# EAGLE design USTREDNA (EAGLE 7.7.0)
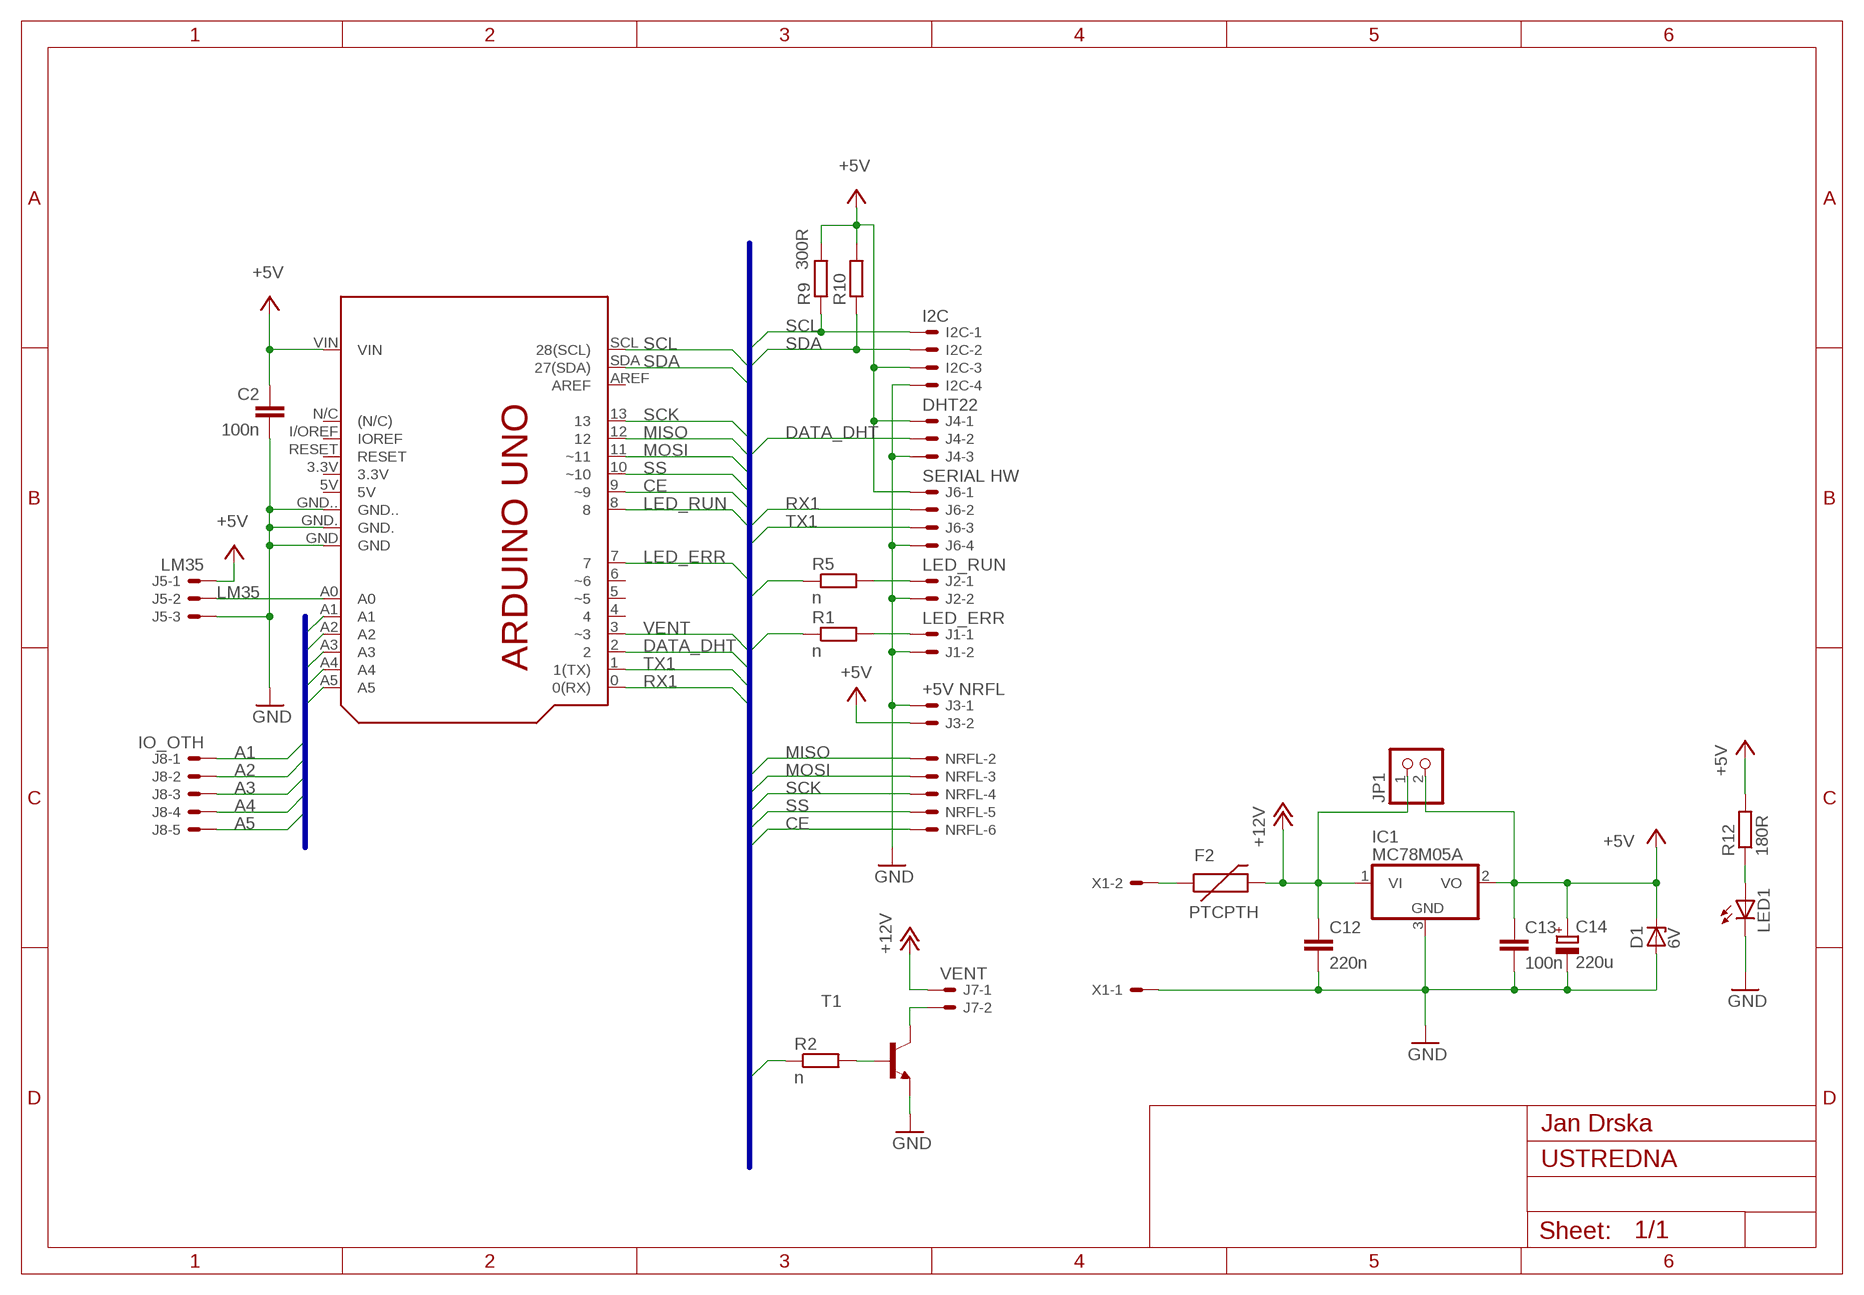
[diagram p0: schematic, sheet 1]

## Parts
C2  100n  C-EUC0603  [C0603]
C12  220n  C-EUC0603  [C0603]
C13  100n  C-EUC0603  [C0603]
C14  220u  CPOL-EUE2,5-6E  [E2,5-6E]
D1  6V  ZENER-DIODESMB  [SMB]
F2  PTCPTH  [PTC]
I2C  I2C  22-27-2041-04  [6410-04]
IC1  MC78M05A  7808DT  [TO252]
J1  LED_ERR  22-27-2021-02  [6410-02]
J2  LED_RUN  22-27-2021-02  [6410-02]
J3  +5V NRFL  22-27-2021-02  [6410-02]
J4  DHT22  22-27-2031-03  [6410-03]
J5  LM35  22-27-2031-03  [6410-03]
J6  SERIAL HW  22-27-2041-04  [6410-04]
J7  VENT  22-27-2021-02  [6410-02]
J8  IO_OTH  22-27-2051-05  [6410-05]
JP1  PINHD-1X2  [1X02]
LED1  LEDCHIP-LED0603  [CHIP-LED0603]
NRFL  NRFL  22-27-2061-06  [6410-06]
PCB1  ARDUINO_UNO  [ARDUINO_UNO]
R1  n  R-EU_R0603  [R0603]
R2  n  R-EU_R0603  [R0603]
R5  n  R-EU_R0603  [R0603]
R9  R-EU_R0603  [R0603]
R10  300R  R-EU_R0603  [R0603]
R12  180R  R-EU_R0603  [R0603]
T1  -NPN-SOT223  [SOT223]
X1  22-23-2021  [22-23-2021]

## Nets
+5V: C2.1 C13.1 C14.+ D1.C I2C.3 IC1.2(VO) J3.2 J4.1 J5.1 J6.1 JP1.2 PCB1.VIN R9.2 R10.2 R12.2
+12V: C12.1 F2.P$2 IC1.1(VI) J7.1 JP1.1
A1: J8.1 PCB1.A1
A2: J8.2 PCB1.A2
A3: J8.3 PCB1.A3
A4: J8.4 PCB1.A4
A5: J8.5 PCB1.A5
CE: NRFL.6 PCB1.9(~9)
DATA_DHT: J4.2 PCB1.2
GND: C2.2 C12.2 C13.2 C14.- D1.A I2C.4 IC1.3(GND) J1.2 J2.2 J3.1 J4.3 J5.3 J6.4 LED1.C PCB1.GND PCB1.GND. PCB1.GND.. T1.3(E) X1.1
LED_ERR: PCB1.7 R1.1
LED_RUN: PCB1.8 R5.1
LM35: J5.2 PCB1.A0
MISO: NRFL.2 PCB1.12
MOSI: NRFL.3 PCB1.11(~11)
N$1: J1.1 R1.2
N$2: R2.2 T1.1(B)
N$3: J2.1 R5.2
N$4: J7.2 T1.4(C)
N$8: F2.P$1 X1.2
N$11: LED1.A R12.1
RX1: J6.2 PCB1.0(0(RX))
SCK: NRFL.4 PCB1.13
SCL: I2C.1 PCB1.SCL(28(SCL)) R9.1
SDA: I2C.2 PCB1.SDA(27(SDA)) R10.1
SS: NRFL.5 PCB1.10(~10)
TX1: J6.3 PCB1.1(1(TX))
VENT: PCB1.3(~3) R2.1
Unconnected: NRFL.1 PCB1.3.3V PCB1.4 PCB1.5(~5) PCB1.5V PCB1.6(~6) PCB1.AREF PCB1.I/OREF(IOREF) PCB1.N/C((N/C)) PCB1.RESET

## Buses
SDA,SCL,LED_RUN,RX1,TX1,SCK,MOSI,MISO,SS,CE,LED_ERR,DATA_DHT,VENT
A[1..5]

## Library data of the parts
C2 C12 C13 = rcl:C-EU: CAPACITOR, European symbol
C14 = rcl:CPOL-EU: POLARIZED CAPACITOR, European symbol
D1 = diode:ZENER-DIODE: Z-Diode
F2 = SparkFun:PTC: Resettable Fuse PTC Resettable Fuse. Spark Fun Electronics SKU : COM-08357
I2C J6 = con-molex:22-?-04: CONNECTOR wire to board 2.54 mm (.1 inch) pitch header; OC_FARNELL: unknown; OC_NEWARK: unknown
IC1 = linear:78*: Positive VOLTAGE REGULATOR Source: http://cache.national.com/ds/LM/LM78L05.pdf http://www.fairchildsemi.com/ds/LM/LM7805.pdf
J1-J3 J7 = con-molex:22-?-02: CONNECTOR wire to board 2.54 mm (.1 inch) pitch header; OC_FARNELL: unknown; OC_NEWARK: unknown
J4 J5 = con-molex:22-?-03: CONNECTOR wire to board 2.54 mm (.1 inch) pitch header; OC_FARNELL: unknown; OC_NEWARK: unknown
J8 = con-molex:22-?-05: CONNECTOR wire to board 2.54 mm (.1 inch) pitch header; OC_FARNELL: unknown; OC_NEWARK: unknown
JP1 = pinhead:PINHD-1X2: PIN HEADER
LED1 = led:LED: LED OSRAM: - CHIPLED LG R971, LG N971, LY N971, LG Q971, LY Q971, LO R971, LY R971 LH N974, LH R974 LS Q976, LO Q976, LY Q976 LO Q996 - Hyper CHIPLED LW Q18S LB Q993, LB Q99A, LB R99A - SideLED LS A670, LO A670, LY A670, LG A670, LP A670 LB A673, LV A673, LT A673, LW A673 LH A674 LY A675 LS A676, LA A676, LO A676, LY A676, LW A676 LS A679, LY A679, LG A679 - Hyper Micro SIDELED® LS Y876, LA Y876, LO Y876, LY Y876 LT Y87S - SmartLED LW L88C, LW L88S LB L89C, LB L89S, LG L890 LS L89K, LO L89K, LY L89K LS L896, LA L896, LO L896, LY L896 - TOPLED LS T670, LO T670, LY T670, LG T670, LP T670 LSG T670, LSP T670, LSY T670, LOP T670, LYG T670 LG T671, LOG T671, LSG T671 LB T673, LV T673, LT T673, LW T673 LH T674 LS T676, LA T676, LO T676, LY T676, LB T676, LH T676, LSB T676, LW T676 LB T67C, LV T67C, LT T67C, LS T67K, LO T67K, LY T67K, LW E67C LS E67B, LA E67B, LO E67B, LY E67B, LB E67C, LV E67C, LT E67C LW T67C LS T679, LY T679, LG T679 LS T770, LO T770, LY T770, LG T770, LP T770 LB T773, LV T773, LT T773, LW T773 LH T774 LS E675, LA E675, LY E675, LS T675 LS T776, LA T776, LO T776, LY T776, LB T776 LHGB T686 LT T68C, LB T68C - Hyper Mini TOPLED® LB M676 - Mini TOPLED Santana® LG M470 LS M47K, LO M47K, LY M47K Source: http://www.osram.convergy.de LUXEON: - LUMILED® LXK2-PW12-R00, LXK2-PW12-S00, LXK2-PW14-U00, LXK2-PW14-V00 LXK2-PM12-R00, LXK2-PM12-S00, LXK2-PM14-U00 LXK2-PE12-Q00, LXK2-PE12-R00, LXK2-PE12-S00, LXK2-PE14-T00, LXK2-PE14-U00 LXK2-PB12-K00, LXK2-PB12-L00, LXK2-PB12-M00, LXK2-PB14-N00, LXK2-PB14-P00, LXK2-PB14-Q00 LXK2-PR12-L00, LXK2-PR12-M00, LXK2-PR14-Q00, LXK2-PR14-R00 LXK2-PD12-Q00, LXK2-PD12-R00, LXK2-PD12-S00 LXK2-PH12-R00, LXK2-PH12-S00 LXK2-PL12-P00, LXK2-PL12-Q00, LXK2-PL12-R00 Source: www.luxeon.com KINGBRIGHT: KA-3528ASYC Source: www.kingbright.com
NRFL = con-molex:22-?-06: CONNECTOR wire to board 2.54 mm (.1 inch) pitch header; OC_FARNELL: unknown; OC_NEWARK: unknown
PCB1 = E14_Arduino_revC:ARDUINO_UNO: Device for representing an Arduino Uno board with a footprint in an EAGLE design. Created by Dave Young for Element14. More EAGLE documentation at: http://www.element14.com/community/community/knode/cadsoft_eagle
R1 R2 R5 R9 R10 R12 = rcl:R-EU_: RESISTOR, European symbol
T1 = transistor-neu-to92:*-NPN-: NPN Transistror
X1 = con-molex:22-23-2021: .100" (2.54mm) Center Header - 2 Pin; MF: MOLEX; MPN: 22-23-2021; OC_FARNELL: 1462926; OC_NEWARK: 25C3832

## Board
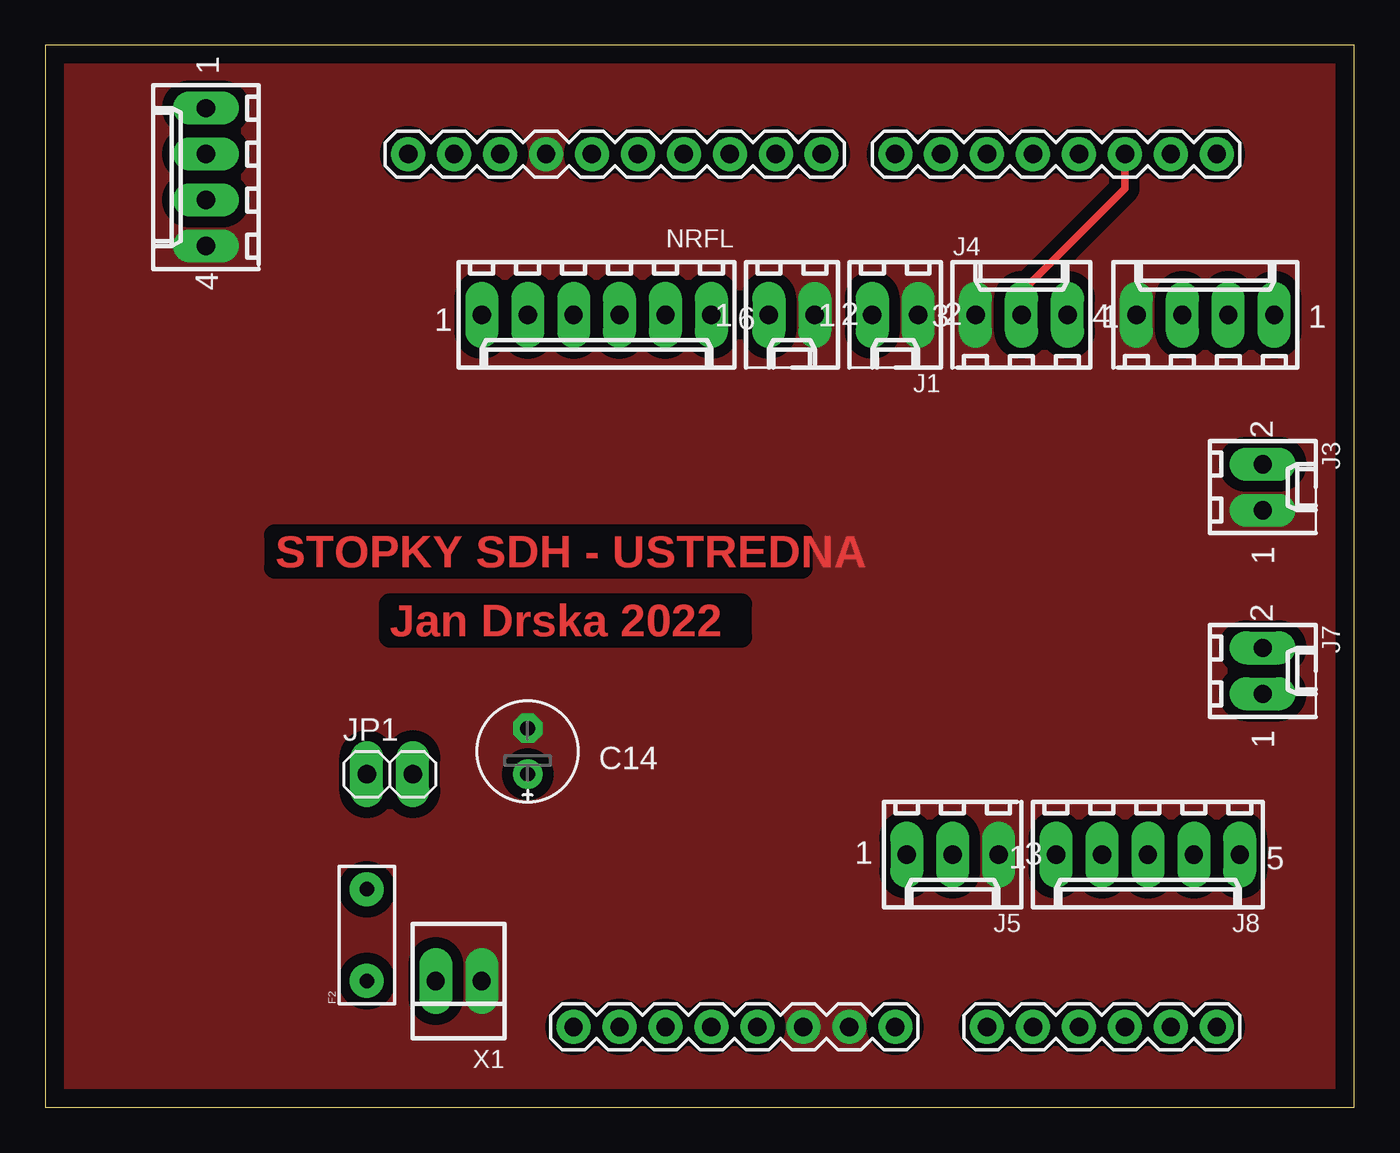
[diagram p1: board, top side]
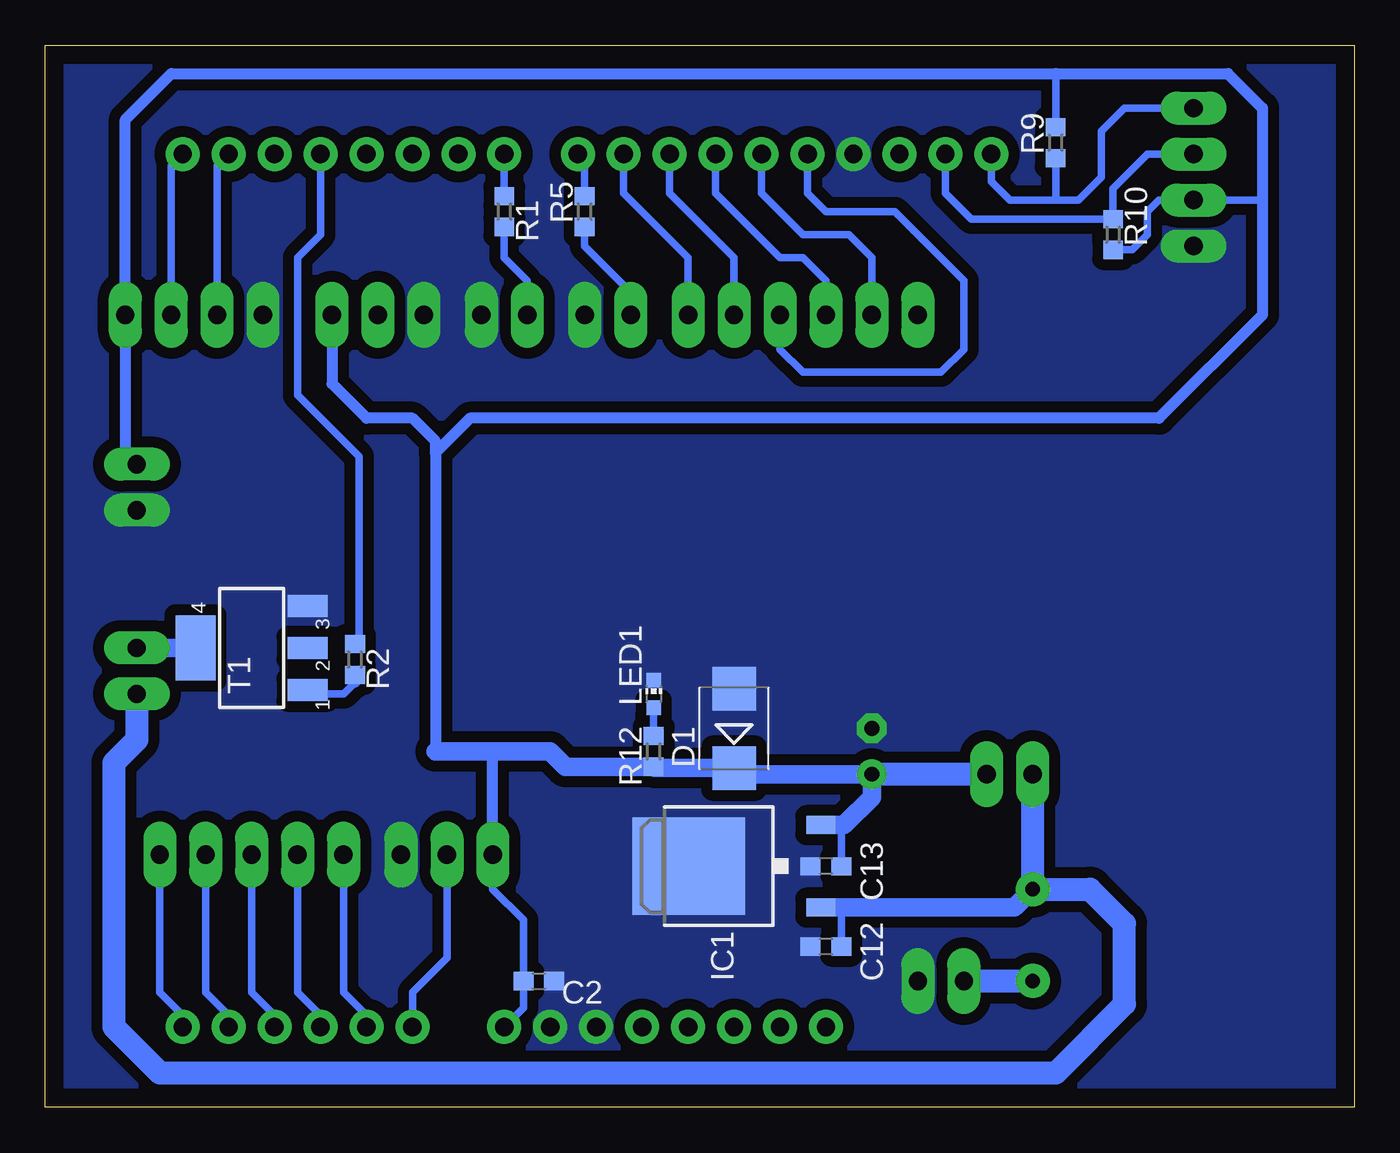
[diagram p2: board, bottom side, seen from below]

Size 72.37 x 58.73 mm. Coordinates in mm from the lower left corner, seen from the top.
Outline: 0,0 72.37,0 72.37,58.73 0,58.73 0,0
Copper layers (1*16): Top 0.035mm / dielectric 1.5mm / Bottom 0.035mm
Design rules "VUT": minimum track width 10mil, minimum drill 24mil, track to track 10mil, track to pad 8mil, pad to pad 8mil, via to via 8mil, smd to smd 8mil, copper to edge 40mil, drill to drill 8mil, minimum pad ring 16mil, minimum via ring 16mil, stop-mask expansion 4mil, vias tented up to drill 0mil, thermal gap 10mil

### Footprints (pad centres in the part's own frame; a part is rotated, then mirrored left to right if it is on the bottom)
C0603 = smd 1.1 x 1: 1 -0.85,0; 2 0.85,0
E2,5-6E = drill 0.813 pad 1.575: + -1.27,0 | drill 0.813 pad 1.575 octagon: - 1.27,0
SMB = smd 2.4 x 2.4: A 2.2,0; C -2.2,0
PTC = drill 0.8 pad 1.88: P$1 -2.54,0; P$2 2.54,0
6410-04 = drill 1.016 long: 1 3.81,0; 2 1.27,0; 3 -1.27,0; 4 -3.81,0
TO252 = smd 1 x 1.6: 1 -2.28,-4.8; 2 2.28,-4.8 | smd 5.4 x 6.2: 3 0,2.5
6410-02 = drill 1.016 long: 1 1.27,0; 2 -1.27,0
6410-03 = drill 1.016 long: 1 2.54,0; 2 0,0; 3 -2.54,0
6410-05 = drill 1.016 long: 1 5.08,0; 2 2.54,0; 3 0,0; 4 -2.54,0; 5 -5.08,0
1X02 = drill 1.016 long: 1 -1.27,0; 2 1.27,0
CHIP-LED0603 = smd 0.8 x 0.8: A 0,-0.75; C 0,0.75
6410-06 = drill 1.016 long: 1 6.35,0; 2 3.81,0; 3 1.27,0; 4 -1.27,0; 5 -3.81,0; 6 -6.35,0
ARDUINO_UNO = drill 1.016 pad 1.88: 0 63.5,50.8; 1 60.96,50.8; 2 58.42,50.8; 3 55.88,50.8; 3.3V 35.56,2.54; 4 53.34,50.8; 5 50.8,50.8; 5V 38.1,2.54; 6 48.26,50.8; 7 45.72,50.8; 8 41.656,50.8; 9 39.116,50.8; 10 36.576,50.8; 11 34.036,50.8; 12 31.496,50.8; 13 28.956,50.8; A0 50.8,2.54; A1 53.34,2.54; A2 55.88,2.54; A3 58.42,2.54; A4 60.96,2.54; A5 63.5,2.54; AREF 23.876,50.8; GND 26.416,50.8; GND. 43.18,2.54; GND.. 40.64,2.54; I/OREF 30.48,2.54; N/C 27.94,2.54; RESET 33.02,2.54; SCL 18.796,50.8; SDA 21.336,50.8; VIN 45.72,2.54
R0603 = smd 1 x 1.1: 1 -0.85,0; 2 0.85,0
SOT223 = smd 1.219 x 2.235: 1 -2.311,-3.099; 2 0,-3.099; 3 2.311,-3.099 | smd 3.6 x 2.2: 4 0,3.099
22-23-2021 = drill 1 long: 1 -1.27,0; 2 1.27,0

### Placement (x,y rotation side)
C2  45.09,6.99 0 bottom
C12  29.21,8.89 180 bottom
C13  29.21,13.34 180 bottom
C14  26.67,19.68 90 top
D1  34.29,20.95 90 bottom
F2  17.78,9.53 90 top
I2C  8.89,51.44 90 top
IC1  34.29,13.34 90 bottom
J1  46.99,43.81 180 top
J2  41.27,43.81 180 top
J3  67.31,34.29 270 top
J4  53.98,43.81 0 top
J5  50.16,13.97 180 top
J6  64.14,43.81 0 top
J7  67.31,24.13 270 top
J8  60.96,13.97 180 top
JP1  19.05,18.41 0 top
LED1  38.73,22.86 0 bottom
NRFL  30.48,43.81 180 top
PCB1  1.27,1.91 0 top
R1  46.99,49.53 270 bottom
R2  55.24,24.77 270 bottom
R5  42.55,49.53 270 bottom
R9  16.51,53.34 90 bottom
R10  13.34,48.26 270 bottom
R12  38.73,19.68 270 bottom
T1  60.96,25.4 90 bottom
X1  22.86,6.99 180 top

### Tracks (layer width: path | path; a pad name or v marks a point on that pad's centre or on a via)
+5V
  Bottom 0.406: PCB1.VIN 45.94,5.5 C2.1 45.94,10.38 47.62,12.06 J5.1 | C13.1 28.36,15.46 28.2,15.62 | 5.08,50.16 I2C.3 10.79,50.16 11.43,49.53 11.43,48.26 12.28,47.41 R10.2 | R9.2 16.51,57.15
  Bottom 0.61: 50.8,36.2 50.8,19.68 | J3.2 67.94,36.2 J6.1 67.94,54.61 65.41,57.15 16.51,57.15 6.99,57.15 5.08,55.24 5.08,50.16 5.08,43.81 10.79,38.1 48.9,38.1 50.8,36.2 | J5.1 47.62,19.68 | 50.8,36.2 50.8,36.83 52.07,38.1 54.61,38.1 56.52,40.01 J4.1
  Bottom 1.016: 50.8,19.68 47.62,19.68 44.45,19.68 43.6,18.84 R12.2 38.66,18.75 D1.C 33.95,18.41 C14.+ 26.67,17.14 28.2,15.62 IC1.2
  Bottom 1.27: JP1.2 C14.+
+12V
  Bottom 0.406: 28.57,11.05 28.16,10.84 28.36,10.63 C12.1
  Bottom 1.016: IC1.1 28.57,11.05 18.79,11.05 F2.P$2
  Bottom 1.27: JP1.1 F2.P$2 14.61,12.06 12.7,10.16 12.7,5.71 16.51,1.91 66.04,1.91 68.58,4.45 68.58,19.05 67.31,20.32 J7.1
A1
  Bottom 0.406: PCB1.A1 54.61,5.08 55.88,6.35 J8.1
A2
  Bottom 0.406: PCB1.A2 57.15,5.08 58.42,6.35 J8.2
A3
  Bottom 0.406: PCB1.A3 59.69,5.08 60.96,6.35 J8.3
A4
  Bottom 0.406: PCB1.A4 62.23,5.08 63.5,6.35 J8.4
A5
  Bottom 0.406: PCB1.A5 64.77,5.08 66.04,6.35 J8.5
CE
  Bottom 0.406: PCB1.9 40.39,50.55 36.83,46.99 NRFL.6
DATA_DHT
  Top 0.406: J4.2 53.98,45.09 59.69,50.8 PCB1.2
GND
  pour Top (isolate 0.61, no thermals): 0,59.05 72.39,59.05 72.39,0 0,0
  pour Bottom (isolate 0.61, no thermals): 0,59.05 72.39,59.05 72.39,0 0,0
LED_ERR
  Bottom 0.406: R1.1 PCB1.7
LED_RUN
  Bottom 0.406: R5.1 42.55,52.32 PCB1.8
LM35
  Bottom 0.406: PCB1.A0 52.07,6.35 50.16,8.26 J5.2
MISO
  Bottom 0.406: PCB1.12 32.77,50.55 30.48,48.26 27.94,48.26 26.67,46.99 NRFL.2
MOSI
  Bottom 0.406: PCB1.11 35.31,50.55 31.75,46.99 30.48,46.99 29.21,45.72 NRFL.3
N$1
  Bottom 0.406: J1.1 45.72,45.72 46.99,46.99 R1.2
N$2
  Bottom 0.406: 55.24,23.5 55.88,22.86 57.63,22.86
  Bottom 0.61: R2.2 55.24,23.5 | 57.63,22.86 T1.1
N$3
  Bottom 0.406: J2.1 40.01,45.09 42.55,47.62 R5.2
N$4
  Bottom 1.016: T1.4 J7.2
N$8
  Bottom 1.27: X1.2 F2.P$1
N$11
  Bottom 0.406: R12.1 LED1.A
RX1
  Bottom 0.406: J6.2 65.41,52.07 PCB1.0
SCK
  Bottom 0.406: NRFL.4 31.75,41.91 30.48,40.64 22.86,40.64 21.59,41.91 21.59,45.72 25.4,49.53 29.21,49.53 30.23,50.55 PCB1.13
SCL
  Bottom 0.406: I2C.1 12.7,55.24 13.97,53.98 13.97,51.44 15.24,50.16 16.51,50.16 | 16.51,50.16 19.05,50.16 20.07,51.18 PCB1.SCL | R9.1 16.51,50.16
SDA
  Bottom 0.406: PCB1.SDA 22.61,50.55 21.17,49.11 R10.1 13.34,50.8 11.43,52.7 I2C.2
SS
  Bottom 0.406: PCB1.10 37.85,50.55 34.29,46.99 NRFL.5
TX1
  Bottom 0.406: J6.3 62.87,52.07 PCB1.1
VENT
  Bottom 0.406: PCB1.3 57.15,48.26 58.42,46.99 58.42,39.37 55.03,35.98 55.03,25.83
  Bottom 0.61: 55.03,25.83 R2.1

### Text on the board
Top: STOPKY SDH - USTREDNA | Jan Drska 2022